# Altium schematic sheet RV-3028_Real-Time_Clock.SchDoc: RV-3028-C7 Real-Time Clock
size A4
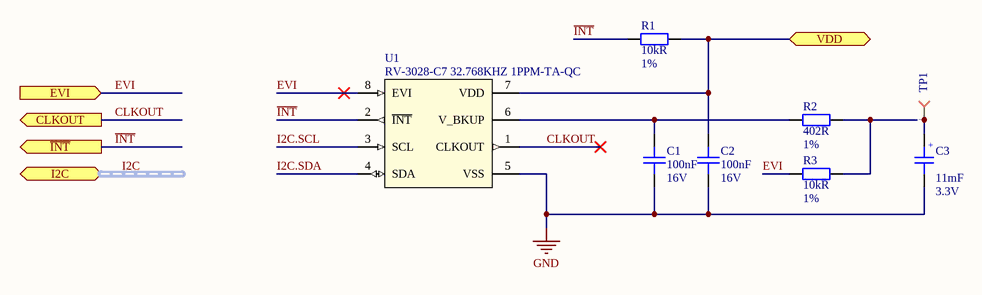
[diagram p0: RV-3028_Real-Time_Clock.SchDoc]

## Parts
C1  Capacitance: 100nF  Voltage: 16V  [C0402]  (hidden comment: CAP CER 0.1UF 16V X7R 0402)
C2  Capacitance: 100nF  Voltage: 16V  [C0402]  (hidden comment: CAP CER 0.1UF 16V X7R 0402)
C3  Capacitance: 11mF  Voltage Rating: 3.3V  [CAPCP3225X100N]  (hidden comment: CAP 11MF 3.3V SURFACE MNT)
R1  Resistance: 10kR  Tolerance: 1%  [R0402]  (hidden comment: RES SMD 10K OHM 1% 1/16W 0402)
R2  Resistance: 402R  Tolerance: 1%  [R0402]  (hidden comment: RES SMD 402 OHM 1% 1/16W 0402)
R3  Resistance: 10kR  Tolerance: 1%  [R0402]  (hidden comment: RES SMD 10K OHM 1% 1/16W 0402)
TP1  Test Point Pad  [Testpoint]  (value not drawn)  (no BOM)
U1  RV-3028-C7 32.768KHZ 1PPM-TA-QC  [8-SON (3.2x1.5)]

## Ports
CLKOUT (out), EVI (in), I2C (harness I2C), VDD, ~{INT} (out)

## Nets
GND: C1.1 C2.1 C3.2 U1.5(VSS)
~{INT}: R1.2 U1.2(~{INT}) ; port ~{INT}
CLKOUT: U1.1(CLKOUT) ; port CLKOUT
EVI: R3.2 U1.8(EVI) ; port EVI
I2C.SCL: U1.3(SCL)
I2C.SDA: U1.4(SDA)
VDD: C2.2 R1.1 U1.7(VDD) ; port VDD
NetC1_2: C1.2 R2.1 U1.6(V_BKUP)
NetC3_1: C3.1 R2.2 R3.1 TP1.1

## Buses and harness runs
harness I2C = port I2C

## Notes on the sheet
- Title
- Size:
- Date:
- A4
- Number:
- Time:
- Revision:
- Sheet
- of
- File:
- (in symbol CAP 11MF 3.3V SURFACE MNT) +

## Library data of the parts
C1 C2 = CAP CER 0.1UF 16V X7R 0402: 0.1µF ±10% 16V Ceramic Capacitor X7R 0402 (1005 Metric); Manufacturer Part Number: CC0402KRX7R7BB104; Manufacturer: Yageo; Revision: July-2002: Re-released for DXP Platform.; Order: CC0402KRX7R7BB104; Supplier 1: Digi-Key; Stock 1: 25916830; Pricing 1: 1=0.1, 10=0.031, 100=0.0136, 500=0.0097, 1000=0.0077, 2500=0.007, 5000=0.0064 (USD); Mount: Surface Mount; Number of Pins: 2; Case Code (Metric): 1005; Case Code (Imperial): 0402; Min Operating Temperature: -55°C; Max Operating Temperature: 125°C; Tolerance: 10%; Dielectric: X7R; Voltage Rating: 16V; Voltage Rating (DC): 16V; Packaging: Tape and Reel; Package Quantity: 1; Termination: SMD/SMT; Composition: Ceramic; Length: 1mm; Height: 0.5mm; Width: 0.02inch; Thickness: 0.022inch; Depth: 0.5mm; Radiation Hardening: No; REACH SVHC: No SVHC; Lead Free: Lead Free; Halogen Free: Halogen Free; ComponentLink1URL: http://www.yageo.com/documents/recent/UPY-GPHC_X7R_6.3V-to-50V_8.pdf?src-supplier=Avnet+Europe; ComponentLink1Description: http://www.yageo.com/documents/recent/UPY-GPHC_X7R_6.3V-to-50V_8.pdf?src-supplier=Avnet+Europe; ComponentLink2URL: http://www.yageo.com/documents/recent/UPY-GPHC_X7R_6.3V-to-50V_18.pdf?src-supplier=Digi-Key; ComponentLink2Description: http://www.yageo.com/documents/recent/UPY-GPHC_X7R_6.3V-to-50V_18.pdf?src-supplier=Digi-Key; ComponentLink3URL: http://www.yageo.com/documents/recent/UPY-GPHC_X7R_6.3V-to-50V_8.pdf?src-supplier=Avnet; ComponentLink3Description: http://www.yageo.com/documents/recent/UPY-GPHC_X7R_6.3V-to-50V_8.pdf?src-supplier=Avnet; ComponentLink4URL: http://www.yageo.com/documents/recent/UPY-GPHC_X7R_6.3V-to-50V_18.pdf?src-supplier=Mouser; ComponentLink4Description: http://www.yageo.com/documents/recent/UPY-GPHC_X7R_6.3V-to-50V_18.pdf?src-supplier=Mouser; ComponentLink5URL: http://www.farnell.com/datasheets/2167236.pdf?src-supplier=Element14; ComponentLink5Description: http://www.farnell.com/datasheets/2167236.pdf?src-supplier=Element14; ComponentLink6URL: http://www.farnell.com/datasheets/1489800.pdf?src-supplier=Element14; ComponentLink6Description: http://www.farnell.com/datasheets/1489800.pdf?src-supplier=Element14; Supplier Part Number 1: 311-1338-1-ND
C3 = CAP 11MF 3.3V SURFACE MNT: 11mF (EDLC) Supercapacitor 3.3V 1210 (3225 Metric); Manufacturer: Seiko; Manufacturer Part Number: CPH3225A; ESR (Equivalent Series Resistance): 160R; Supplier 1: Digi-Key; Stock 1: 48098; Pricing 1: 1=2.02, 10=1.634, 50=1.4256, 100=1.2474, 500=0.9504, 1000=0.8316, 2500=0.8019, 5000=0.7722 (USD); Mount: Surface Mount; Case/Package: 1210; Case Code (Metric): 3225; Case Code (Imperial): 1210; Min Operating Temperature: -20°C; Max Operating Temperature: 60°C; Package Quantity: 2000; Packaging: Tape and Reel; Voltage Rating (DC): 3.3V; Termination: SMD/SMT; Length: 3.2mm; Height: 0.9mm; Width: 2.5mm; Height - Seated (Max): 0.035inch; ComponentLink1URL: http://www.sii.co.jp/en/me/datasheets/chip-capacitor/cph3225a/?src-supplier=Mouser; ComponentLink1Description: http://www.sii.co.jp/en/me/datasheets/chip-capacitor/cph3225a/?src-supplier=Mouser; ComponentLink2URL: http://www.sii-components.com/document/en/battery/Chip_Capacitor_E.pdf?src-supplier=Avnet+Asia; ComponentLink2Description: http://www.sii-components.com/document/en/battery/Chip_Capacitor_E.pdf?src-supplier=Avnet+Asia; ComponentLink3URL: https://media.digikey.com/pdf/Data%20Sheets/Seiko%20Instruments%20PDFs/CPH3225A_CP3225A.pdf?src-supplier=Digi-Key; ComponentLink3Description: https://media.digikey.com/pdf/Data%20Sheets/Seiko%20Instruments%20PDFs/CPH3225A_CP3225A.pdf?src-supplier=Digi-Key; Supplier Part Number 1: 728-1127-1-ND
R1 R3 = RES SMD 10K OHM 1% 1/16W 0402: 10 kOhms ±1% 0.063W, 1/16W Chip Resistor 0402 (1005 Metric) Moisture Resistant Thick Film; Manufacturer Part Number: RC0402FR-0710KP; Manufacturer: Yageo; Temperature Coefficient: 150ppm/°C; Max Power Dissipation: 63mW; Supplier 1: Digi-Key; Stock 1: 839368; Pricing 1: 1=0.1, 10=0.035, 100=0.014, 1000=0.0063, 2500=0.0055, 5000=0.0045 (USD); Case Code (Imperial): 0402; Case Code (Metric): 1005; Min Operating Temperature: -55°C; Max Operating Temperature: 155°C; Composition: Thick Film; Packaging: Tape and Reel; Number of Terminations: 2; Length: 0.039inch; Height: 0.016inch; Width: 0.02inch; ComponentLink1URL: http://www.yageo.com/NewPortal/yageodocoutput?fileName=/pdf/R-Chip/PYu-RC_51_RoHS_P_0.pdf&src-supplier=Digi-Key; ComponentLink1Description: http://www.yageo.com/NewPortal/yageodocoutput?fileName=/pdf/R-Chip/PYu-RC_51_RoHS_P_0.pdf&src-supplier=Digi-Key; Supplier Part Number 1: YAG1249CT-ND; Case/Package: 0402; Features: Moisture Resistant; Mount: Surface Mount
R2 = RES SMD 402 OHM 1% 1/16W 0402: 402 Ohms ±1% 0.063W, 1/16W Chip Resistor 0402 (1005 Metric) Moisture Resistant Thick Film; Manufacturer: Yageo; Manufacturer Part Number: RC0402FR-07402RL; Max Power Dissipation: 63mW; Temperature Coefficient: 100ppm/°C; Power Rating: 62.5mW; Voltage Rating: 50V; Supplier 1: Digi-Key; Stock 1: 0; Pricing 1: 1=0.1, 10=0.016, 100=0.0064, 1000=0.0029, 2500=0.0025, 5000=0.0021 (USD); Case/Package: 0402; Case Code (Metric): 1005; Case Code (Imperial): 0402; Contact Plating: Tin,Matte; Min Operating Temperature: -55°C; Max Operating Temperature: 155°C; Packaging: Tape and Reel; Composition: Thick Film; Number of Terminations: 2; Features: Moisture Resistant; Length: 0.039inch; Height: 0.016inch; Width: 0.02inch; ComponentLink1URL: http://www.yageo.com/documents/recent/PYu-RC0402_51_RoHS_L_6.pdf?src-supplier=Avnet; ComponentLink1Description: http://www.yageo.com/documents/recent/PYu-RC0402_51_RoHS_L_6.pdf?src-supplier=Avnet; ComponentLink2URL: http://www.yageo.com/documents/recent/PYu-RC0402_51_RoHS_L_6.pdf?src-supplier=Avnet+Europe; ComponentLink2Description: http://www.yageo.com/documents/recent/PYu-RC0402_51_RoHS_L_6.pdf?src-supplier=Avnet+Europe; ComponentLink3URL: http://www.mouser.com/ds/2/447/PYu-RC0402_51_RoHS_L_6_r-8721.pdf?src-supplier=Mouser; ComponentLink3Description: http://www.mouser.com/ds/2/447/PYu-RC0402_51_RoHS_L_6_r-8721.pdf?src-supplier=Mouser; Supplier Part Number 1: YAG3152CT-ND; Termination: SMD/SMT; Military Standard: Not; Depth: 0.5mm; Lead Free: Lead Free; Mount: Surface Mount
TP1 = Test Point Pad: Test Point. There is nothing to buy or mount.; ClassName: TestPoint; CompType: TestPoint; Manufacturer: N/A; MountType: N/A; PackageReference: TetsPoint; PartNumber: N/A
U1 = IC RV-3028 RTC CLK/CALENDAR I2C 8-SMT: 2-Bit Bidirectional Voltage-Level Translator for Open-Drain Application; Manufacturer: Micro Crystal; Supplier 1: Digi-Key; Manufacturer Part Number: RV-3028-C7 32.768KHZ 1PPM-TA-QC; Stock 1: 4121; Pricing 1: 1=2.71, 10=2.435, 25=2.3016, 100=1.9949, 250=1.8926, 500=1.6982 (USD); Supplier Part Number 1: 2195-RV-3028-C732.768KHZ1PPM-TA-QCCT-ND; Mount: Surface Mount